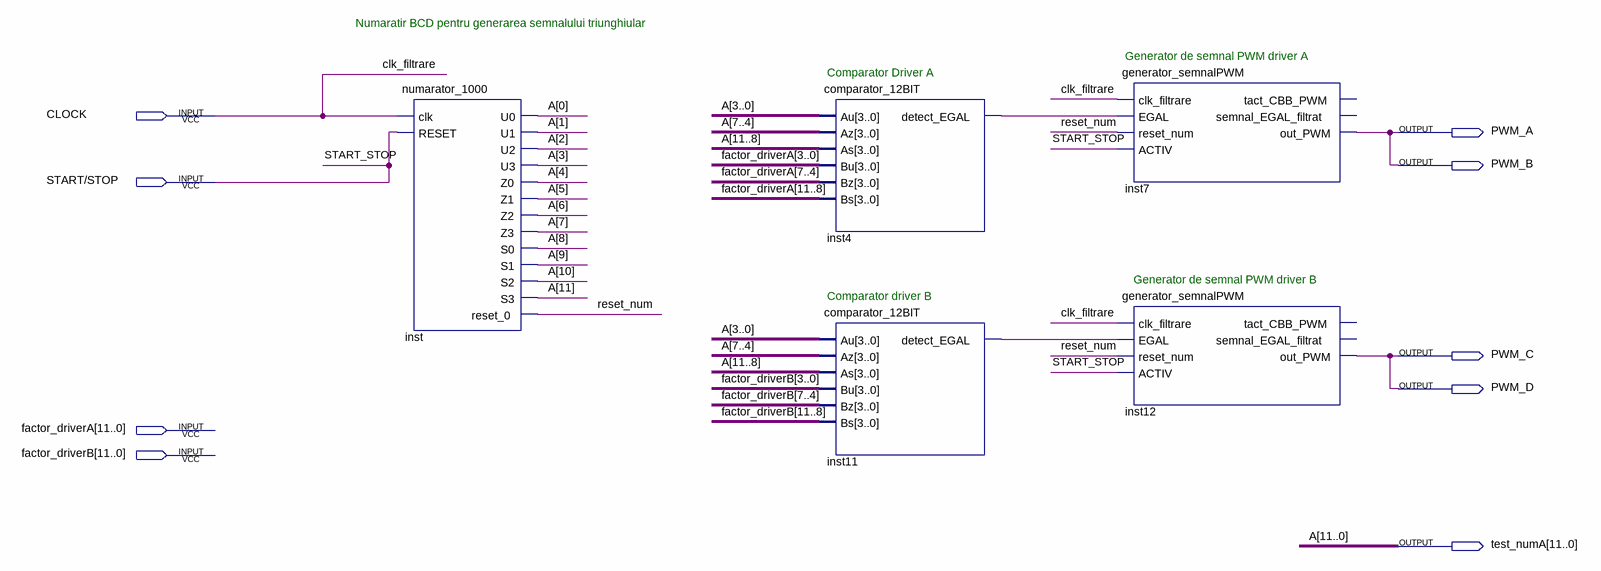
[diagram p0: schematic sheet]
// Quartus schematic generator_PWM.bdf as structural Verilog: 5 symbols, 9 pins
module generator_PWM (
  input  CLOCK,
  input  \START/STOP ,
  input  [11:0] factor_driverA,
  input  [11:0] factor_driverB,
  output PWM_A,
  output PWM_B,
  output PWM_C,
  output PWM_D,
  output [11:0] test_numA
);

  wire inst4_detect_egal, inst11_detect_egal, reset_num;

  numarator_1000 inst (
    .clk(CLOCK), .RESET(\START/STOP ), .U0(test_numA[0]), .U1(test_numA[1]), .U2(test_numA[2]),
    .U3(test_numA[3]), .Z0(test_numA[4]), .Z1(test_numA[5]), .Z2(test_numA[6]), .Z3(test_numA[7]),
    .S0(test_numA[8]), .S1(test_numA[9]), .S2(test_numA[10]), .S3(test_numA[11]), .reset_0(reset_num));
  comparator_12BIT inst4 (
    .Au(test_numA[3:0]), .Az(test_numA[7:4]), .As(test_numA[11:8]), .Bu(factor_driverA[3:0]),
    .Bz(factor_driverA[7:4]), .Bs(factor_driverA[11:8]), .detect_EGAL(inst4_detect_egal));
  comparator_12BIT inst11 (
    .Au(test_numA[3:0]), .Az(test_numA[7:4]), .As(test_numA[11:8]), .Bu(factor_driverB[3:0]),
    .Bz(factor_driverB[7:4]), .Bs(factor_driverB[11:8]), .detect_EGAL(inst11_detect_egal));
  generator_semnalPWM inst7 (
    .clk_filtrare(CLOCK), .EGAL(inst4_detect_egal), .reset_num(reset_num), .ACTIV(\START/STOP ),
    .out_PWM(PWM_A));  // open: tact_CBB_PWM, semnal_EGAL_filtrat
  generator_semnalPWM inst12 (
    .clk_filtrare(CLOCK), .EGAL(inst11_detect_egal), .reset_num(reset_num), .ACTIV(\START/STOP ),
    .out_PWM(PWM_C));  // open: tact_CBB_PWM, semnal_EGAL_filtrat

  assign PWM_B = PWM_A;
  assign PWM_D = PWM_C;

  // Other names for the same wires on the sheet: A[11:0] = test_numA; clk_filtrare = CLOCK; START_STOP = \START/STOP 

  // Notes on the sheet:
  //   Numaratir BCD pentru generarea semnalului triunghiular
  //   Generator de semnal PWM driver A
  //   Comparator Driver A
  //   Generator de semnal PWM driver B
  //   Comparator driver B
endmodule
